# Altium schematic sheet CHILD_BOARD.SchDoc
size B; SheetNumber: 1; SheetTotal: 8
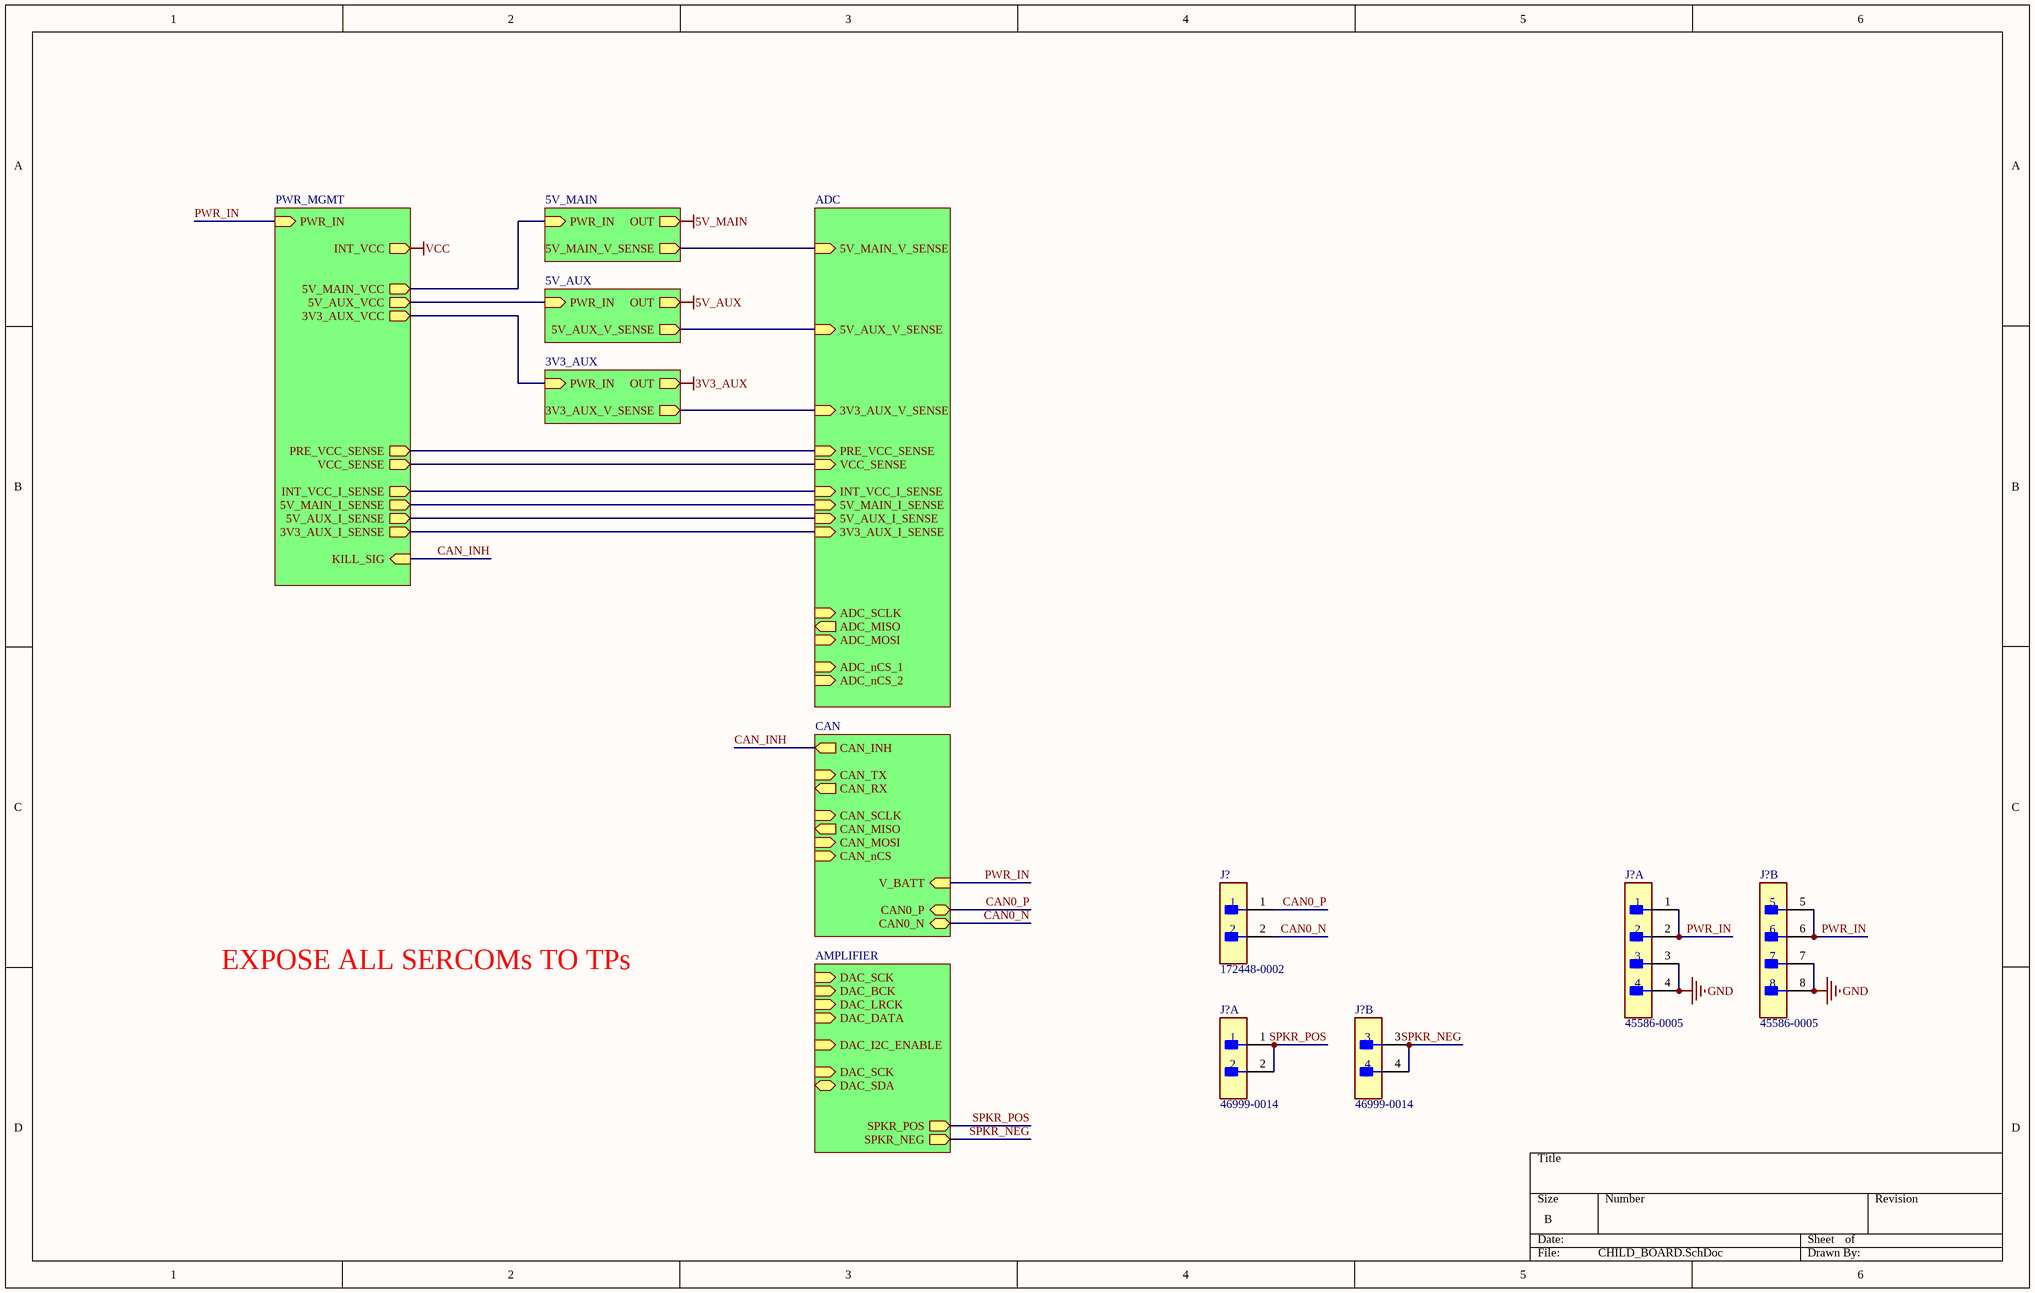
[diagram p0: CHILD_BOARD.SchDoc]

## Parts
(Parts that share a designator on the sheet are numbered #1, #2 ... from top to bottom, then left to right.)
J?#1  172448-0002  [FP-172448-0002-MFG]
J?#2  45586-0005  [FP-45586-0005-MFG]  (part A of 2)
J?#3  45586-0005  [FP-45586-0005-MFG]  (part B of 2)
J?#4  46999-0014  [FP-46999-0014-MFG]  (part A of 2)
J?#5  46999-0014  [FP-46999-0014-MFG]  (part B of 2)

## Sub-sheets
3V3_AUX = 3V3_AUX: PWR_IN (in), OUT (out), 3V3_AUX_V_SENSE (out)
5V_AUX = 5V_AUX: PWR_IN (in), OUT (out), 5V_AUX_V_SENSE (out)
5V_MAIN = 5V_MAIN: PWR_IN (in), OUT (out), 5V_MAIN_V_SENSE (out)
ADC = ADC: 5V_MAIN_V_SENSE (in), 3V3_AUX_V_SENSE (in), 5V_AUX_V_SENSE (in), INT_VCC_I_SENSE (in), 5V_MAIN_I_SENSE (in), 5V_AUX_I_SENSE (in), 3V3_AUX_I_SENSE (in), PRE_VCC_SENSE (in), VCC_SENSE (in), ADC_SCLK (in), ADC_MISO (out), ADC_MOSI (in), ADC_nCS_1 (in), ADC_nCS_2 (in)
AMPLIFIER = AMPLIFIER: DAC_SCK (in), DAC_BCK (in), DAC_LRCK (in), DAC_DATA (in), DAC_I2C_ENABLE (in), DAC_SCK (in), DAC_SDA (bidir), SPKR_POS (out), SPKR_NEG (out)
CAN = CAN: CAN_TX (in), CAN_RX (out), CAN_SCLK (in), CAN_MISO (out), CAN_MOSI (in), CAN_nCS (in), CAN_INH (out), CAN0_P (bidir), CAN0_N (bidir), V_BATT (in)
PWR_MGMT = PWR_MGMT: PWR_IN (in), INT_VCC (out), 5V_MAIN_VCC (out), 5V_AUX_VCC (out), 3V3_AUX_VCC (out), PRE_VCC_SENSE (out), VCC_SENSE (out), INT_VCC_I_SENSE (out), 5V_MAIN_I_SENSE (out), 5V_AUX_I_SENSE (out), 3V3_AUX_I_SENSE (out), KILL_SIG (in)

## Nets
3V3_AUX: sheet 3V3_AUX/OUT
5V_AUX: sheet 5V_AUX/OUT
5V_MAIN: sheet 5V_MAIN/OUT
GND: J?#2.3 J?#2.4 J?#3.7 J?#3.8
VCC: sheet PWR_MGMT/INT_VCC
CAN0_N: J?#1.2 ; sheet CAN/CAN0_N
CAN0_P: J?#1.1 ; sheet CAN/CAN0_P
CAN_INH: sheet PWR_MGMT/KILL_SIG, sheet CAN/CAN_INH
PWR_IN: J?#2.1 J?#2.2 J?#3.5 J?#3.6 ; sheet PWR_MGMT/PWR_IN, sheet CAN/V_BATT
SPKR_NEG: J?#5.3 J?#5.4 ; sheet AMPLIFIER/SPKR_NEG
SPKR_POS: J?#4.1 J?#4.2 ; sheet AMPLIFIER/SPKR_POS
(unnamed): sheet PWR_MGMT/5V_MAIN_VCC, sheet 5V_MAIN/PWR_IN
(unnamed): sheet PWR_MGMT/5V_AUX_VCC, sheet 5V_AUX/PWR_IN
(unnamed): sheet PWR_MGMT/3V3_AUX_VCC, sheet 3V3_AUX/PWR_IN
(unnamed): sheet PWR_MGMT/PRE_VCC_SENSE, sheet ADC/PRE_VCC_SENSE
(unnamed): sheet PWR_MGMT/VCC_SENSE, sheet ADC/VCC_SENSE
(unnamed): sheet PWR_MGMT/INT_VCC_I_SENSE, sheet ADC/INT_VCC_I_SENSE
(unnamed): sheet PWR_MGMT/5V_MAIN_I_SENSE, sheet ADC/5V_MAIN_I_SENSE
(unnamed): sheet PWR_MGMT/5V_AUX_I_SENSE, sheet ADC/5V_AUX_I_SENSE
(unnamed): sheet PWR_MGMT/3V3_AUX_I_SENSE, sheet ADC/3V3_AUX_I_SENSE
(unnamed): sheet 5V_MAIN/5V_MAIN_V_SENSE, sheet ADC/5V_MAIN_V_SENSE
(unnamed): sheet 5V_AUX/5V_AUX_V_SENSE, sheet ADC/5V_AUX_V_SENSE
(unnamed): sheet 3V3_AUX/3V3_AUX_V_SENSE, sheet ADC/3V3_AUX_V_SENSE

## Notes on the sheet
- EXPOSE ALL SERCOMs TO TPs

## Library data of the parts
J?#1 = CMP-04780-000002-1: CONN HEADER R/A 2POS; Row Spacing: 0.165inch; Number of Circuits: 2; Connector Type: Male Pin; Glow Wire Compliant: Compliant; Number of Pins: 2; Mount: Through Hole; Number of Positions: 2; Number of Rows: 2; Color: Black; Contact Plating: Tin; Fastening Type: Ramp; Termination: Solder; RoHS Compliant: Yes; Packaging: Tray; Orientation: Right Angle
J?#2 J?#3 = CMP-04776-000690-1: CONN HEADER R/A 8POS 4.2MM
J?#4 J?#5 = CMP-04776-000148-1: CONN HEADER R/A 4POS 4.2MM; Gender: Male; Mount: Through Hole; Number of Pins: 4; Termination: Solder; Pitch: 4.2mm; RoHS Compliant: Yes; Orientation: Right Angle